# EAGLE design CrackberryPi (EAGLE 6.5.0)
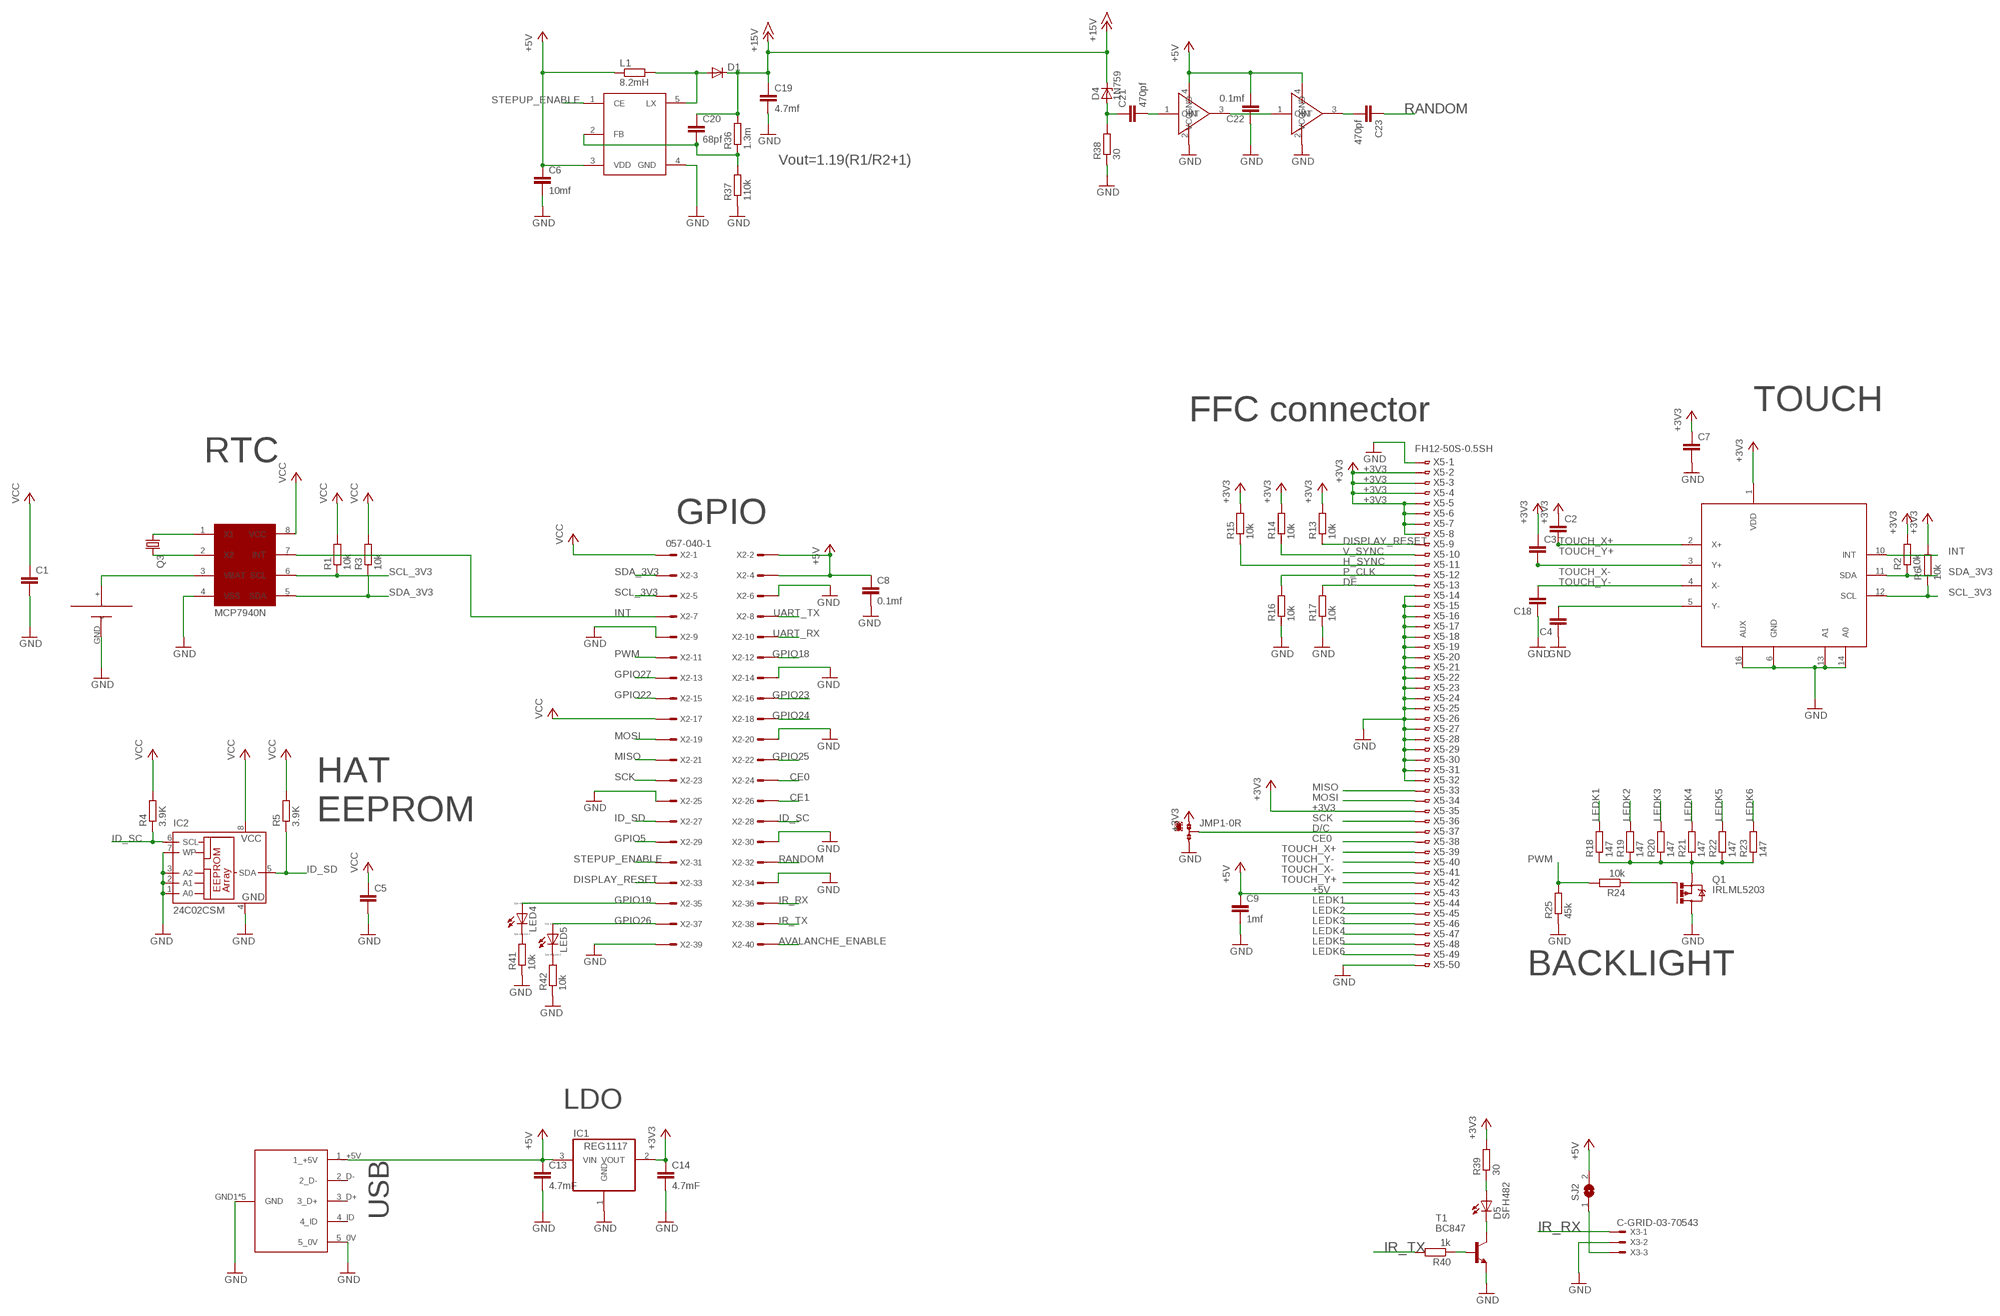
[diagram p0: schematic, sheet 1]

## Parts
C1  C-EUC0603  [C0603]
C2  C-EUC0603  [C0603]
C3  C-EUC0603  [C0603]
C4  C-EUC0603  [C0603]
C5  C-EUC0603  [C0603]
C6  10mf  C-EUC0603  [C0603]
C7  C-EUC0603  [C0603]
C8  0.1mf  C-EUC0603  [C0603]
C9  1mf  C-EUC0603  [C0603]
C13  4.7mF  C-EUC0603  [C0603]
C14  4.7mF  C-EUC0603  [C0603]
C18  C-EUC0603  [C0603]
C19  4.7mf  C-EUC0603  [C0603]
C20  68pf  C-EUC0603  [C0603]
C21  470pf  C-EUC0603  [C0603]
C22  0.1mf  C-EUC0603  [C0603]
C23  470pf  C-EUC0603  [C0603]
D1  DIODE-SOD123  [SOD123]
D4  1N759  ZENER-DIODESOD80C  [SOD80C]
D5  SFH482  [SFH482]
IC1  REG1117  [SOT223]
IC2  24C02CSM  [SO-08M]
JMP1  0R-JUMPC  [C0R-JMP]
L1  8.2mH  R-EU_R1210  [R1210]
LED4  LED_ESML0603  [LED_SML0603]
LED5  LED_ESML0603  [LED_SML0603]
Q1  IRLML5203  [MICRO3]
Q3  CRYSTALMM20SS  [MM20SS]
R1  10k  R-EU_R0603  [R0603]
R2  10k  R-EU_R0603  [R0603]
R3  10k  R-EU_R0603  [R0603]
R4  3.9K  R-EU_R0603  [R0603]
R5  3.9K  R-EU_R0603  [R0603]
R6  10k  R-EU_R0603  [R0603]
R13  10k  R-EU_R0603  [R0603]
R14  10k  R-EU_R0603  [R0603]
R15  10k  R-EU_R0603  [R0603]
R16  10k  R-EU_R0603  [R0603]
R17  10k  R-EU_R0603  [R0603]
R18  147  R-EU_R0603  [R0603]
R19  147  R-EU_R0603  [R0603]
R20  147  R-EU_R0603  [R0603]
R21  147  R-EU_R0603  [R0603]
R22  147  R-EU_R0603  [R0603]
R23  147  R-EU_R0603  [R0603]
R24  10k  R-EU_R0603  [R0603]
R25  45k  R-EU_R0603  [R0603]
R36  1.3m  R-EU_R0603  [R0603]
R37  110k  R-EU_R0603  [R0603]
R38  30  R-EU_R0603  [R0603]
R39  30  R-EU_R0603  [R0603]
R40  1k  R-EU_R0603  [R0603]
R41  10k  R-EU_R0603  [R0603]
R42  10k  R-EU_R0603  [R0603]
SJ2  SJ  [SJ]
T1  BC847  [SOT23]
U$2  NCP1406  [SOT23-5L]
U$3  MAX2650  [SOT143-W]
U$4  CR1216  [CR1216]
U$5  MCP7940N  [SO08]
U$6  TSC2007  [TSSOP16]
U$9  MICRO_USB  [MICRO_USB]
U$10  MAX2650  [SOT143-W]
X2  057-040-1  [057-040-1]
X3  C-GRID-03-70543  [70543-03]
X5  FH12-50S-0.5SH  [FH12-50S-0.5SH]

## Nets
+3V3: C2.1 C3.1 C7.1 C14.1 IC1.2(VOUT) JMP1.1 R2.2 R6.2 R13.2 R14.2 R15.2 R39.2 U$6.1(VDD) X5.2 X5.3 X5.4 X5.5 X5.6 X5.7 X5.8 X5.35
+5V: C6.1 C8.1 C9.1 C13.1 C22.2 IC1.3(VIN) L1.1 SJ2.2 U$2.3(VDD) U$3.4(VCC) U$9.1_+5V U$10.4(VCC) X2.2 X2.4 X5.43
+15V: C19.1 C20.1 D1.C D4.C R36.2
AVALANCHE_ENABLE: X2.40
BASE: R40.1 T1.1(B)
CE0: X2.24 X5.38
CE1: X2.26
COLLECTOR: D5.K(C) T1.3(C)
D/C: JMP1.2 X5.37
DE: R17.2 X5.13
DISPLAY_RESET: R13.1 X2.33 X5.9
EMITTER: T1.2(E) ; supply symbol labelled GND
FB: C20.2 R36.1 R37.2 U$2.2(FB)
GND: C1.2 C4.1 C5.2 C6.2 C7.2 C8.2 C9.2 C13.2 C14.2 C18.1 C19.2 C22.1 IC1.1(GND) IC2.1(A0) IC2.2(A1) IC2.3(A2) IC2.4(GND) IC2.7(WP) JMP1.3 Q1.3(D) R16.1 R17.1 R25.1 R37.1 R38.1 R41.1 R42.1 U$2.4(GND) U$3.2(GND) U$4.GND(-) U$5.4(VSS) U$6.6(GND) U$6.13(A1) U$6.14(A0) U$6.16(AUX) U$9.5_0V U$9.GND1(GND) U$9.GND2(GND) U$9.GND5(GND) U$9.P$1(GND) U$9.P$7(GND) U$10.2(GND) X2.6 X2.9 X2.14 X2.20 X2.25 X2.30 X2.34 X2.39 X3.2 X5.1 X5.14 X5.15 X5.16 X5.17 X5.18 X5.19 X5.20 X5.21 X5.22 X5.23 X5.24 X5.25 X5.26 X5.27 X5.28 X5.29 X5.30 X5.31 X5.32 X5.50
GPIO5: X2.29
GPIO18: X2.12
GPIO19: LED4.A X2.35
GPIO22: X2.15
GPIO23: X2.16
GPIO24: X2.18
GPIO25: X2.22
GPIO26: LED5.A X2.37
GPIO27: X2.13
H_SYNC: R15.1 X5.11
ID_SC: IC2.6(SCL) R4.1 X2.28
ID_SD: IC2.5(SDA) R5.1 X2.27
IN_1: C21.2 U$3.1(IN)
INT: U$5.7(INT) U$6.10(INT) X2.7
IR_RX: X2.36 X3.1
IR_TX: R40.2 X2.38
LEDK1: R18.2 X5.44
LEDK2: R19.2 X5.45
LEDK3: R20.2 X5.46
LEDK4: R21.2 X5.47
LEDK5: R22.2 X5.48
LEDK6: R23.2 X5.49
LX: D1.A L1.2 U$2.5(LX)
MISO: X2.21 X5.33
MOSI: X2.19 X5.34
N$4: SJ2.1 X3.3
N$12: Q1.2(S) R18.1 R19.1 R20.1 R21.1 R22.1 R23.1
N$16: C21.1 D4.A R38.2
N$20: Q1.1(G) R24.1
N$30: D5.A R39.1
N$35: LED4.C R41.2
N$36: LED5.C R42.2
OUT1_IN2: U$3.3(OUT) U$10.1(IN)
OUT2: C23.2 U$10.3(OUT)
P_CLK: R16.2 X5.12
PWM: R24.2 R25.2 X2.11
RANDOM: C23.1 X2.32
SCK: X2.23 X5.36
SCL_3V3: R1.1 R6.1 U$5.6(SCL) U$6.12(SCL) X2.5
SDA_3V3: R2.1 R3.1 U$5.5(SDA) U$6.11(SDA) X2.3
STEPUP_ENABLE: U$2.1(CE) X2.31
TOUCH_X+: C2.2 U$6.2(X+) X5.39
TOUCH_X-: C18.2 U$6.4(X-) X5.41
TOUCH_Y+: C3.2 U$6.3(Y+) X5.42
TOUCH_Y-: C4.2 U$6.5(Y-) X5.40
UART_RX: X2.10
UART_TX: X2.8
V_SYNC: R14.1 X5.10
VBAT+: U$4.+ U$5.3(VBAT)
VCC: C1.1 C5.1 IC2.8(VCC) R1.2 R3.2 R4.2 R5.2 U$5.8(VCC) X2.1 X2.17
X1_RTC: Q3.1 U$5.1(X1)
X2_RTC: Q3.4 U$5.2(X2)
Unconnected: U$9.2_D- U$9.3_D+ U$9.4_ID

## Notes on the sheet
- Vout=1.19(R1/R2+1)
- FFC connector | TOUCH
- RTC
- GPIO
- MCP7940N
- HAT
  EEPROM
- BACKLIGHT
- LDO
- USB

## Library data of the parts
C1-C9 C13 C14 C18-C23 = rcl:C-EU: CAPACITOR, European symbol
D1 = diode:DIODE-: DIODE
D4 = diode:ZENER-DIODE: Z-Diode
D5 = led:SFH482: IR LED infrared emitting diode, Infineon
IC1 = burr-brown:REG1117: 800mA and 1A Low Dropout (LDO) Positive Regulator 1.8V, 2.5V, 2.85V, 3.3V, 5V, and Adj; MPN: REG1117; OC_FARNELL: 1097566; OC_NEWARK: 14P6981
IC2 = microchip:24C*: Serial EEPROM 1 K/2 K/4 K; MF: MICROCHIP; MPN: 24C02C-I/SN; OC_FARNELL: 1084339; OC_NEWARK: 96K4063
JMP1 = jump-0r-smd:0R-JUMP: SMD 0R 0805 Jumper
L1 R1-R6 R13-R25 R36-R42 = rcl:R-EU_: RESISTOR, European symbol
LED4 LED5 = eagle-ltspice:LED_E: LED Source: http://www.osram.convergy.de Source: www.luxeon.com Source: www.kingbright.com; SPICEMODEL: NONE; SPICEPREFIX: D; SPICETYPE: diode
Q1 = transistor-power:IRLML5203: HEXFET P-Channel Power MOSFET
Q3 = crystal:CRYSTAL: CRYSTAL; OC_FARNELL: unknown; OC_NEWARK: unknown
SJ2 = jumper:SJ: SMD solder JUMPER
T1 = transistor:BC847: NPN TRANSISTOR
U$2 = ncp1406:NCP1406
U$3 U$10 = max2650:MAX2650
U$4 = cr1216:CR1216
U$5 = MCP7940N:MCP7940N
U$6 = tsc2046:TSC2007
U$9 = MICRO_USB:MICRO_USB
X2 = con-panduit:057-040-: CONNECTOR 40-pin series 057 contact pc board low profile headers; OC_FARNELL: unknown; OC_NEWARK: unknown
X3 = con-molex:C-GRID-03: CONNECTOR wire to board 2.54 mm (0.100") pitch header; OC_FARNELL: unknown; OC_NEWARK: unknown
X5 = FCI_62684:FH12-50S-0.5S: 0.5mm Pitch Connectors For FPC/FFC Source: Data sheet <http://www.hirose.co.jp/cataloge_hp/e58605370.pdf>; MPN: FH12-50S-0.5SH(55); OC_FARNELL: 1324557; OC_NEWARK: 34M6181

## Board
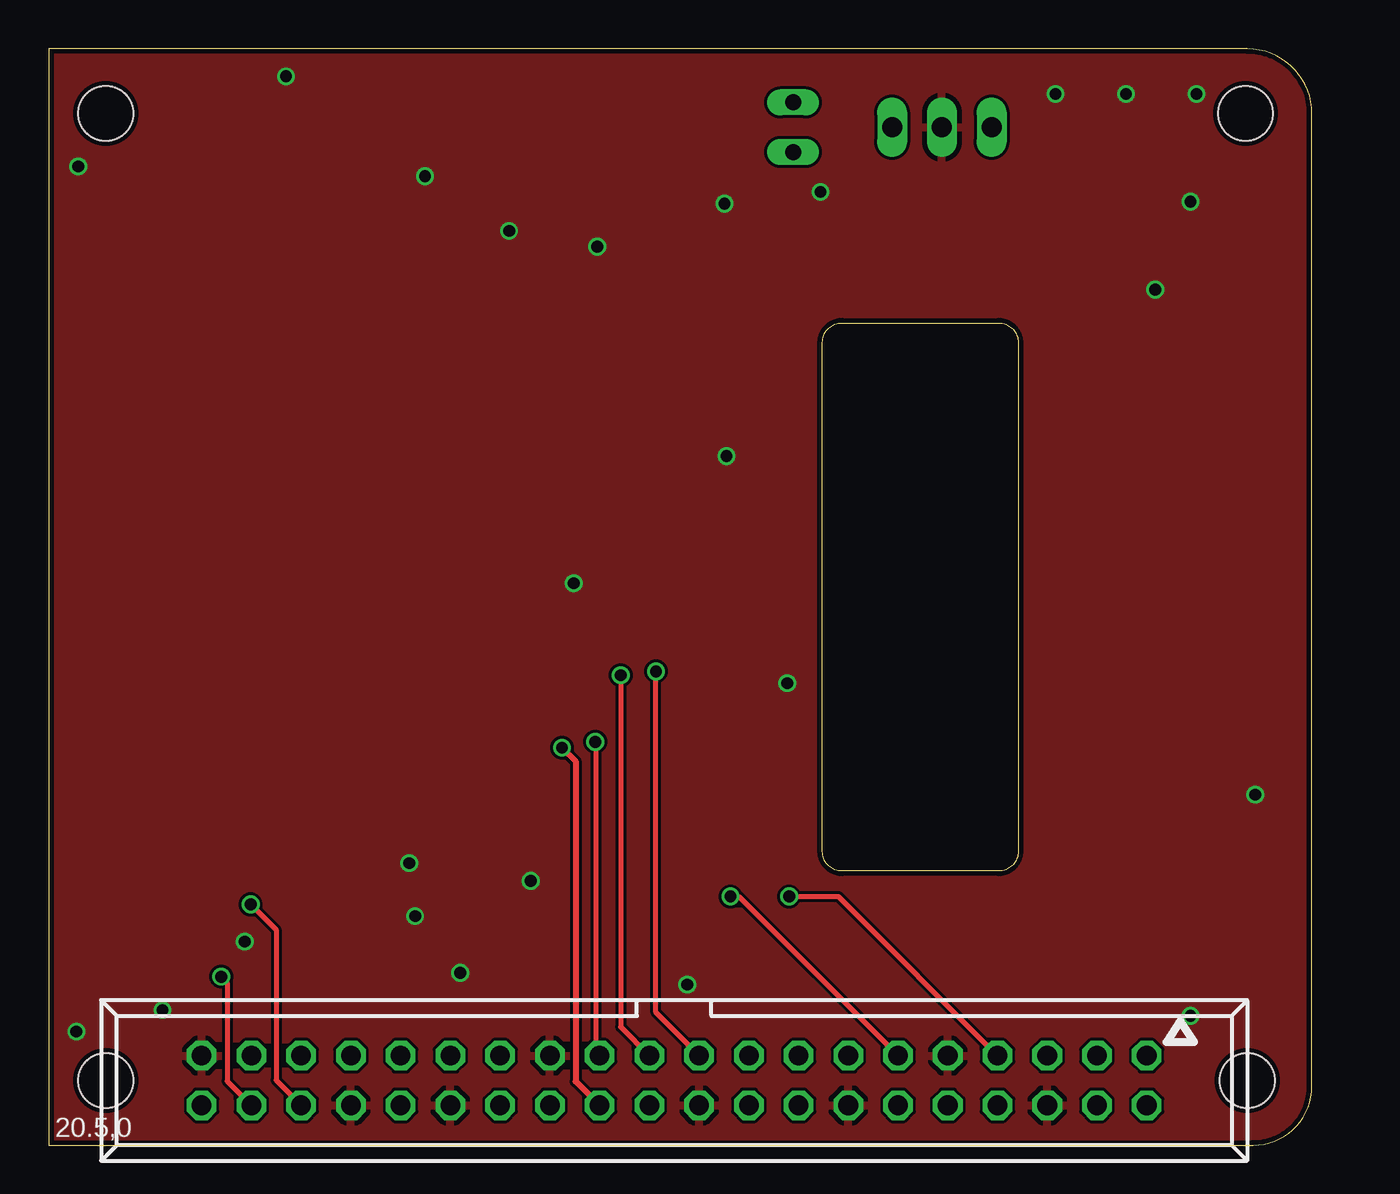
[diagram p1: board, top side]
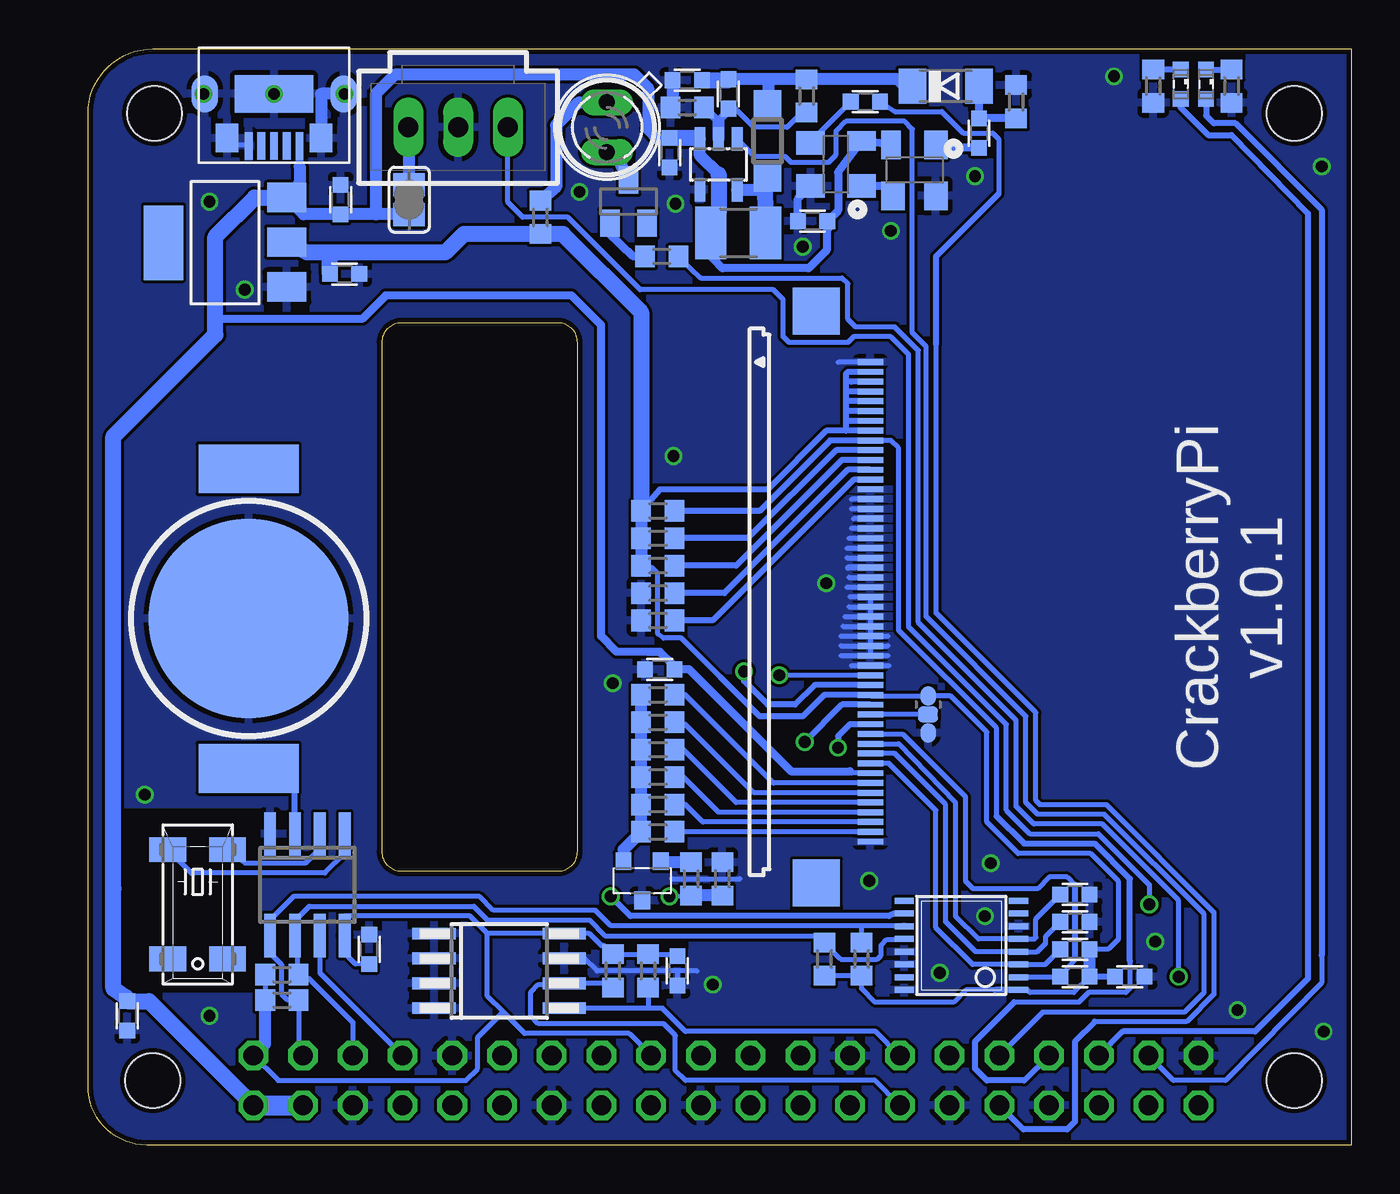
[diagram p2: board, bottom side, seen from below]

Size 64.5 x 56 mm. Coordinates in mm from the lower left corner, seen from the top.
Outline: 0,0 61.5,0 arc90 64.5,3 64.5,52.7 arc90 61.2,56 0,56 0,0
Outline: 39.5,15 39.5,41 arc-90 40.5,42 48.5,42 arc-90 49.5,41 49.5,15 arc-90 48.5,14 40.5,14 arc-90 39.5,15
Copper layers (1*16): Top 0.035mm / dielectric 1.5mm / Bottom 0.035mm
Design rules "SeeedStudio_2layer_DRU_no_angle_20140221": minimum track width 6mil, minimum drill 12mil, track to track 6mil, track to pad 6mil, pad to pad 6mil, via to via 6mil, smd to smd 0mil, copper to edge 10mil, drill to drill 10mil, minimum pad ring 10mil, minimum via ring 6mil, stop-mask expansion 2mil, vias tented up to drill 100mil, thermal gap 10mil
Holes 2.8 mm at 61.2,3.3 61.1,52.7 2.9,52.7 2.9,3.3
bRestrict: area 55.7,7.8 to 62.8,17.2

### Footprints (pad centres in the part's own frame; a part is rotated, then mirrored left to right if it is on the bottom)
C0603 = smd 0.8 x 0.8: 1 -0.75,0; 2 0.75,0
SOD123 = smd 1.4 x 1.4: A 1.9,0; C -1.9,0
SOD80C = smd 1.4 x 1.8: A 1.7,0; C -1.7,0
SFH482 = drill 0.813 long: A -1.27,0; K 1.27,0
SOT223 = smd 1.499 x 2.007: 1 -2.261,-3.15; 2 0.025,-3.15; 3 2.311,-3.15 | smd 3.81 x 2.007: 4 0,3.15
SO-08M = smd 0.6 x 2.2: 1 -1.905,-3.33; 2 -0.635,-3.33; 3 0.635,-3.33; 4 1.905,-3.33; 5 1.905,3.33; 6 0.635,3.33; 7 -0.635,3.33; 8 -1.905,3.33
C0R-JMP = smd 0.8 x 1: 1 0,0.938; 3 0,-0.938 | smd 1 x 0.8: 2 0,0
R1210 = smd 1.6 x 2.7: 1 -1.4,0; 2 1.4,0
LED_SML0603 = smd 0.8 x 0.8: A 0.75,0; C -0.75,0
MICRO3 = smd 0.8 x 0.9: 1 -0.95,-1; 2 0.95,-1; 3 0,1
MM20SS = smd 1.27 x 1.88: 1 -2.794,-1.524; 2 2.794,-1.524; 3 2.794,1.524; 4 -2.794,1.524
R0603 = smd 1 x 1.1: 1 -0.85,0; 2 0.85,0
SJ = smd 1.168 x 1.6: 1 -0.762,0; 2 0.762,0
SOT23 = smd 1 x 1.4: 1 -0.95,-1.1; 2 0.95,-1.1; 3 0,1.1
SOT23-5L = smd 0.55 x 1.2: 1 -0.95,-1.3; 2 0,-1.3; 3 0.95,-1.3; 4 0.95,1.3; 5 -0.95,1.3
SOT143-W = smd 1.2 x 1.45: 1 -1.1,-1.3; 2 -1.1,1.3; 3 1.1,1.3 | smd 1 x 1.45: 4 1.2,-1.3
CR1216 = smd 2.5 x 5.1: + -7.65,0; P$2 7.65,0 | smd 10.2 x 10.2: GND 0,0
SO08 = smd 0.6 x 2.2: 1 -1.905,-2.6; 2 -0.635,-2.6; 3 0.635,-2.6; 4 1.905,-2.6; 5 1.905,2.6; 6 0.635,2.6; 7 -0.635,2.6; 8 -1.905,2.6
TSSOP16 = smd 0.305 x 0.991: 1 -2.275,-2.918; 2 -1.625,-2.918; 3 -0.975,-2.918; 4 -0.325,-2.918; 5 0.325,-2.918; 6 0.975,-2.918; 7 1.625,-2.918; 8 2.275,-2.918; 9 2.275,2.918; 10 1.625,2.918; 11 0.975,2.918; 12 0.325,2.918; 13 -0.325,2.918; 14 -0.975,2.918; 15 -1.625,2.918; 16 -2.275,2.918
MICRO_USB = smd 0.4 x 1.4: 1_+5V -1.3,2.65; 2_D- -0.65,2.65; 3_D+ 0,2.65; 4_ID 0.65,2.65; 5_0V 1.3,2.65 | smd 4 x 1.9: GND1 0,0 | smd 1.35 x 1.9: GND2 -3.55,0; GND5 3.55,0 | smd 1.15 x 1.45: P$1 -2.4,2.25; P$7 2.4,2.25
057-040-1 = drill 1 octagon: 1 -24.13,-1.27; 2 -24.13,1.27; 3 -21.59,-1.27; 4 -21.59,1.27; 5 -19.05,-1.27; 6 -19.05,1.27; 7 -16.51,-1.27; 8 -16.51,1.27; 9 -13.97,-1.27; 10 -13.97,1.27; 11 -11.43,-1.27; 12 -11.43,1.27; 13 -8.89,-1.27; 14 -8.89,1.27; 15 -6.35,-1.27; 16 -6.35,1.27; 17 -3.81,-1.27; 18 -3.81,1.27; 19 -1.27,-1.27; 20 -1.27,1.27; 21 1.27,-1.27; 22 1.27,1.27; 23 3.81,-1.27; 24 3.81,1.27; 25 6.35,-1.27; 26 6.35,1.27; 27 8.89,-1.27; 28 8.89,1.27; 29 11.43,-1.27; 30 11.43,1.27; 31 13.97,-1.27; 32 13.97,1.27; 33 16.51,-1.27; 34 16.51,1.27; 35 19.05,-1.27; 36 19.05,1.27; 37 21.59,-1.27; 38 21.59,1.27; 39 24.13,-1.27; 40 24.13,1.27
70543-03 = drill 1.016 long: 1 -2.54,0; 2 0,0; 3 2.54,0
FH12-50S-0.5SH = smd 1.3 x 0.3: 1 3.95,27.8; 2 3.95,27.3; 3 3.95,26.8; 4 3.95,26.3; 5 3.95,25.8; 6 3.95,25.3; 7 3.95,24.8; 8 3.95,24.3; 9 3.95,23.8; 10 3.95,23.3; 11 3.95,22.8; 12 3.95,22.3; 13 3.95,21.8; 14 3.95,21.3; 15 3.95,20.8; 16 3.95,20.3; 17 3.95,19.8; 18 3.95,19.3; 19 3.95,18.8; 20 3.95,18.3; 21 3.95,17.8; 22 3.95,17.3; 23 3.95,16.8; 24 3.95,16.3; 25 3.95,15.8; 26 3.95,15.3; 27 3.95,14.8; 28 3.95,14.3; 29 3.95,13.8; 30 3.95,13.3; 31 3.95,12.8; 32 3.95,12.3; 33 3.95,11.8; 34 3.95,11.3; 35 3.95,10.8; 36 3.95,10.3; 37 3.95,9.8; 38 3.95,9.3; 39 3.95,8.8; 40 3.95,8.3; 41 3.95,7.8; 42 3.95,7.3; 43 3.95,6.8; 44 3.95,6.3; 45 3.95,5.8; 46 3.95,5.3; 47 3.95,4.8; 48 3.95,4.3; 49 3.95,3.8; 50 3.95,3.3 | smd 2.4 x 2.4: P$1 1.2,1.2; P$2 1.2,30.4

### Placement (x,y rotation side)
C1  50.14,10 90 bottom
C2  14.1,8.6 180 bottom
C3  14.1,10 180 bottom
C4  14.1,12.8 180 bottom
C5  34.4,8.9 270 bottom
C6  34.8,50.7 270 bottom
C7  11.3,8.6 0 bottom
C8  62.5,6.6 270 bottom
C9  35.3,24.3 180 bottom
C13  51.6,48.3 90 bottom
C14  51.4,44.5 0 bottom
C18  14.1,11.4 180 bottom
C19  33.9,54.4 180 bottom
C20  31.8,53.7 270 bottom
C21  19,51.7 270 bottom
C22  27.5,47.2 0 bottom
C23  24.8,53.3 180 bottom
D1  29.8,51.3 270 bottom
D4  20.7,54.1 0 bottom
D5  38,52 270 bottom
IC1  57.5,46.1 90 bottom
IC2  43.5,8.9 270 bottom
JMP1  21.6,22 0 bottom
L1  31.3,46.6 0 bottom
LED4  8.7,54.2 270 bottom
LED5  7.4,54.2 270 bottom
Q1  36.2,13.5 180 bottom
Q3  58.9,12.3 270 bottom
R1  54.6,8.7 180 bottom
R2  25,9.5 270 bottom
R3  54.6,7.4 180 bottom
R4  37.7,8.9 90 bottom
R5  35.9,8.9 90 bottom
R6  26.9,9.5 270 bottom
R13  35.4,32.4 180 bottom
R14  35.4,31 180 bottom
R15  35.4,29.6 180 bottom
R16  35.4,28.2 0 bottom
R17  35.4,26.8 0 bottom
R18  35.4,23 0 bottom
R19  35.4,21.6 0 bottom
R20  35.4,20.2 0 bottom
R21  35.4,18.8 0 bottom
R22  35.4,17.4 0 bottom
R23  35.4,16 0 bottom
R24  33.7,13.6 270 bottom
R25  32.1,13.6 270 bottom
R36  27.8,53.6 90 bottom
R37  33.9,53 0 bottom
R38  17.1,53.3 270 bottom
R39  41.4,47.4 270 bottom
R40  35.2,45.4 0 bottom
R41  10.1,54.1 90 bottom
R42  6.1,54.1 90 bottom
SJ2  48.1,48.3 270 bottom
T1  36.9,48.2 0 bottom
U$2  32.3,50.1 180 bottom
U$3  22.3,49.8 180 bottom
U$4  56.3,26.9 90 bottom
U$5  53.3,13.3 180 bottom
U$6  19.9,10.2 90 bottom
U$9  55,53.7 180 bottom
U$10  26.3,50.1 90 bottom
X2  31.93,3.3 180 top
X3  45.6,52 180 bottom
X5  28.5,12.2 0 bottom

### Tracks (layer width: path | path; a pad name or v marks a point on that pad's centre or on a via)
+3V3
  Bottom 0.254: C2.1 14.15,7.8 16.4,7.8 16.52,7.92 U$6.1 | R6.2 R2.2 25,8 24.3,7.3 20.3,7.3 19.68,7.92 18.18,7.92 | R15.2 36.15,29.5 35.7,29.5 35.4,29.2 35.4,26.1 35.1,25.9 34.2,25.9 32.2,23.9 | C3.1 12.4,10 11.9,10.5 11.9,13.5 13.3,14.9 17,14.9 18.6,16.5 18.6,21.1 20.44,22.94 JMP1.1 24.49,22.94 X5.35
  Bottom 0.305: X5.5 25.8,38 | 25.8,38 25.8,37.5 | 25.8,37.5 25.8,37 | R13.2 36.2,32.45 35.3,33.5 29.8,33.5 26.8,36.5 X5.8 25.8,36.5 25.8,37 | X5.7 25.8,37 | X5.6 25.8,37.5 | X5.4 25.7,38.5 25.8,38.4 | 25.8,38.4 25.8,38 | 25.5,39 X5.3 25.8,39 | X5.2 25.7,39.5 25.8,39.4 25.8,39 | 25.8,39 25.8,38.4 | U$6.1 18.18,7.92 | X5.35 26.9,23 28,21.9 30.2,21.9 32.2,23.9 | C7.1 C2.1
  Bottom 0.61: R13.2 R14.2 R15.2 | C2.1 C3.1
  Bottom 0.813: R39.2 45.31,46.55 46.26,45.6 51.9,45.6 | 41.4,46.5 R39.2 | 51.9,45.6 53.33,45.6 IC1.2 | C14.1 52.15,45.35 51.9,45.6 | R13.2 36.25,42.55 40.25,46.55 R39.2
+5V
  Bottom 0.254: X5.43 25.5,19 25.6,19.1 | 33.8,24.3 34.6,24.2
  Bottom 0.305: U$2.3 33.5,51.45
  Bottom 0.406: U$3.4 U$10.4 26.2,49.7 26.2,47.75 C22.2 | 26.55,47.4 C22.2 | C22.2 26.65,46.85 | 53.7,50 U$9.1_+5V | C9.1 33.8,24.3 28.6,19.1 25.6,19.1 | 32.6,46.7 32.6,45.3 32.1,44.8 27.7,44.8 26.75,45.75 C22.2 | 34.6,24.2 34.6,24.5 35.3,25.2 37.5,25.2 38.3,26 38.3,41.9 39.8,43.4 49.3,43.4 50.5,42.2 58,42.2 | 63.1,13.3 63.2,13.1
  Bottom 0.61: C6.1 34.75,51.4 35.4,51.4 35.9,51.9 35.9,54 36.6,54.7 48.8,54.7 49.8,53.7 49.8,47.55 | 32.3,49.6 33.25,50.55 U$2.3 | 49.8,47.55 C13.1 53.49,47.55 IC1.3 53.7,49.16 53.7,50 | SJ2.2 49.8,47.55
  Bottom 0.813: 33.5,51.45 C6.1 | 32.3,49.6 32.3,47.6 32.6,46.7 32.8,46.8 L1.1 | X2.2 61.38,7.35 C8.1 62.55,7.55 63.2,8 63.2,13.1 63.2,36.2 58,41.4 58,42.2 58,46.4 55.99,48.41 IC1.3
  Bottom 1.016: X2.2 X2.4
+15V
  Bottom 0.406: D4.C 22.9,54.2
  Bottom 0.61: 22.9,54.2 23.15,54.45 R36.2 29.6,54.45 | 29.6,54.45 C20.1 | D1.C 29.7,54.35 29.6,54.45
  Bottom 0.813: C19.1 31.85,54.4 C20.1
BASE
  Bottom 0.406: R40.1 36.65,45.4 37.9,46.6 37.95,47.05 T1.1
CE0  (via drill 0.6)
  Top 0.305: X2.24 26.9,3.25 26.9,19.6 v26.2,20.3
  Bottom 0.305: X5.38 25.6,21.5 26.2,20.9 v26.2,20.3
COLLECTOR
  Bottom 0.61: D5.K 37.7,50.93 T1.3
D/C
  Bottom 0.254: JMP1.2 X5.37
DE
  Bottom 0.305: X5.13 25.4,34 32.6,26.8 R17.2
DISPLAY_RESET
  Bottom 0.254: 11.3,9.4 11.3,8 11.5,7.8 13.4,7.8 13.9,7.3 17.2,7.3 | 18.1,16.8 18.1,21.3 23.1,26.3 23.1,35.6 23.5,36 X5.9
  Bottom 0.305: X5.9 26.6,36 30.2,32.4 R13.1 | X2.33 16.69,3.3 18.6,3.3 19.2,3.9 19.2,5.3 17.2,7.3 | 18.1,16.8 16.7,15.4 13.1,15.4 11.3,13.6 11.3,9.4
FB
  Bottom 0.254: R36.1 28.05,52.75 28.8,52 30.5,52 31.45,52.95 C20.2
  Bottom 0.406: R37.2 32.3,52.3 31.85,52.8 C20.2
  Bottom 0.61: U$2.2 32.3,52.3
GND  (via drill 0.6)
  Bottom 0.254: X5.26 X5.25 25.6,28 | X5.26 X5.31 | U$9.P$7 57.05,51.1 56.3,51.1 | 25.65,31 X5.19 | 25.5,24.5 23.6,24.5 | 24.7,33 25.5,33 | 24.7,32.5 25.5,32.5 | X5.17 25.4,32 | 24.7,31.5 25.5,31.5 | 25.75,30.5 24.65,30.5 | 25.75,30 24.65,30 | 25.65,29 X5.23 | 25.75,28.5 24.65,28.5 | 25.65,27.5 X5.26 | 25.95,26.5 24.85,26.5 | 26.05,25.5 23.65,25.5 | 26.05,26 23.65,26 | 26.05,25 23.65,25 | X5.1 26.2,40 | 33.4,8.9 34.4,8.9 | 34.4,8.9 38.5,8.9 39.1,9.5 40.3,9.5 | 34.4,8.9 34.4,8.1 | 25.85,27 24.75,27 | 34.7,13.6 31.2,13.6
  Bottom 0.305: 24.6,29.5 25.7,29.5
  Bottom 0.406: C22.1 28.25,48.35 U$10.2
  Bottom 0.61: C19.2 34.65,53.1 R37.1 | U$9.GND2 52.6,53.7 U$9.P$1
  other vias: 1.4,5.8 1.5,50 34.5,48.1 39.4,48.7 34.6,35.2 18.7,11.7 37.7,23.6 12.1,54.6 19.2,49.5 51.4,53.7 58.6,53.7 55,53.7 18.4,14.4 26.8,28.7 56.5,43.7 21,8.8 28,45.9 23.5,46.7 10,10.4 5.8,6.9 32.6,8.2 24.6,13.5 61.6,17.9 58.3,6.6 58.3,48.2
  pour Bottom: 0,0 61.49,0 arc90 64.5,3.01 64.5,52.6 arc90 61.1,56 0,56
  pour Top: 4.4,0 61.5,0 arc90 64.5,3 64.5,52.6 arc90 61.1,56 0,56 0,0.1
GPIO19
  Bottom 0.305: LED4.A 8.7,53 7.3,51.6 6.1,51.6 2.2,47.6 2.2,8.5 4.9,5.8 11.65,5.8 X2.35
GPIO26
  Bottom 0.254: 1.5,9.7 1.5,8.3 6.4,3.3 9.07,3.3 X2.37
  Bottom 0.305: LED5.A 7.4,52.6 7,52.2 5.9,52.2 1.5,47.8 1.5,9.7
H_SYNC
  Bottom 0.305: X5.11 26,35 31.4,29.6 R15.1
ID_SC
  Bottom 0.254: R4.1 38.02,8.27 IC2.6 40.23,8.2 41.5,8.2 41.9,7.8 41.9,6.6 41.5,6.2 35.1,6.2 34.5,5.6 34.5,3.8 34,3.3 24.31,3.3 X2.28
ID_SD
  Bottom 0.254: X2.27 24.27,5.8 34,5.8 35.2,7 35.9,7 | IC2.5 35.9,7 | R5.1 35.9,7
IN_1
  Bottom 0.406: C21.2 20.85,50.95 U$3.1
INT  (via drill 0.6)
  Top 0.254: v37.8,12.7 40.31,12.7 X2.7
  Bottom 0.254: 48.44,5.04 X2.7 52.66,8.79 U$5.7
  Bottom 0.305: U$6.10 23.27,11.82 23.6,11.7 36.8,11.7 v37.8,12.7
IR_RX  (via drill 0.6)
  Top 0.254: v10.3,12.3 11.6,11 11.6,3.31 X2.36
  Bottom 0.254: v10.3,12.3 10.3,13.3 12.9,15.9 16.4,15.9 17.6,17.1 17.6,21.5 22.6,26.5 22.6,40.4 23.5,41.3 25.4,41.3 25.7,41 28.7,41 29,41.3 29,43.2 29.5,43.7 36.3,43.7 40,47.4 42.3,47.4 43.06,48.16 X3.1
IR_TX  (via drill 0.6)
  Top 0.254: v8.8,8.6 9.1,8.3 9.1,3.27 X2.38
  Bottom 0.254: R40.2 33.2,44.3 26,44.3 25.7,44 25.7,42.2 25.3,41.8 23.3,41.8 22.1,40.6 22.1,26.7 17.1,21.7 17.1,17.3 16.2,16.4 12.7,16.4 8.8,12.5 v8.8,8.6
LEDK1
  Bottom 0.254: X5.44 29.5,18.5 34,23 R18.2
LEDK2
  Bottom 0.254: X5.45 30.5,18 34,21.5 34.58,21.5 R19.2
LEDK3
  Bottom 0.254: X5.46 31.4,17.5 34.1,20.2 R20.2
LEDK4
  Bottom 0.254: X5.47 32.3,17 34.1,18.8 R21.2
LEDK5
  Bottom 0.254: X5.48 33.1,16.5 34,17.4 R22.2
LEDK6
  Bottom 0.254: X5.49 R23.2
LX
  Bottom 0.61: U$2.5 29.95,48.8
  Bottom 0.813: D1.A 29.95,48.8 L1.2
MISO  (via drill 0.6)
  Top 0.254: v29.2,24 29.2,6.03 X2.21
  Bottom 0.254: X5.33 v29.2,24
MOSI  (via drill 0.6)
  Top 0.254: X2.19 31,6.77 v31,24.2
  Bottom 0.305: X5.34 27.4,23.5 28.4,22.5 29.8,22.5 31,23.7 v31,24.2
N$4
  Bottom 0.61: SJ2.1 48.1,52.4 X3.3
N$12
  Bottom 0.61: R18.1 R19.1 R20.1 R21.1 R22.1 R23.1 37.15,15.1 Q1.2
N$16
  Bottom 0.406: D4.A C21.1 R38.2
N$20
  Bottom 0.61: R24.1 35.1,14.45 Q1.1
N$30
  Bottom 0.61: D5.A 39.43,53.27 40.6,52.1 40.6,48.95 R39.1
N$35
  Bottom 0.305: LED4.C R41.2
N$36
  Bottom 0.305: LED5.C R42.2
OUT1_IN2
  Bottom 0.406: U$3.3 23.7,49 U$10.1
OUT2
  Bottom 0.254: C23.2 27.6,51.25 U$10.3
P_CLK
  Bottom 0.305: X5.12 25.7,34.5 32,28.2 R16.2
PWM  (via drill 0.6)
  Top 0.254: v34.8,12.7 35.23,12.7 X2.11
  Bottom 0.254: v34.8,12.7 33.45,12.75 R24.2
  Bottom 0.61: R25.2 R24.2
RANDOM
  Bottom 0.254: 23.9,53.2 23.3,52.8 20.9,52.8 19.8,51.7 18.3,51.7 18,51.4 18,48.6 | 21.2,40.9 21.2,27.2 16.1,22.1 16.1,17.6 15.9,17.4 12.5,17.4 7,11.9 7,7.7 8.4,6.3 13.1,6.3
  Bottom 0.305: 23.9,53.2 C23.1 | 13.1,6.3 14.1,5.3 14.1,1.2 14.5,0.8 16.73,0.8 X2.32 | 18,48.6 21.2,45.4 21.2,40.9
SCK  (via drill 0.6)
  Top 0.254: X2.23 27.92,4.77 27.92,20.48 v27.9,20.6
  Bottom 0.305: X5.36 26,22.5 v27.9,20.6
SCL_3V3
  Bottom 0.254: U$6.12 22.84,10.5 23.7,10.5 24,10.2 24,9.7 24.2,9.5 26.05,9.5 R6.1 27.15,10.7 38.1,10.7 38.9,11.5 44.1,11.5 44.8,12.2 53.2,12.2 53.9,11.5 53.9,10.73 U$5.6 53.8,10.56 53.8,8.55 R1.1 53.55,8.5 53.2,8.5 50.98,6.28 X2.5
SDA_3V3
  Bottom 0.254: X2.3 53.75,4.94 R3.1 54.3,7.4 54.6,7.7 54.6,9.2 55.2,9.8 U$5.5 55.2,11.5 54,12.7 44.5,12.7 43.8,12 38.6,12 37.8,11.2 25,11.2 | 22.84,11.2 25,11.2 | R2.1 25,11.2
  Bottom 0.305: 22.84,11.2 U$6.11 22.79,11.2
STEPUP_ENABLE
  Bottom 0.254: X2.31 15.73,6.8 8.5,6.8 7.5,7.8 7.5,11.8 12.6,16.9 16,16.9 16.6,17.5 16.6,21.9 21.7,27 21.7,40.8 22.4,41.5 22.4,51.9 22.8,52.3 25.8,52.3 26.3,51.8 26.3,50.6 26.7,50.2 28.6,50.2 28.9,50.5 30.45,50.5 U$2.1
TOUCH_X+
  Bottom 0.254: 14.1,9.5 C2.2 15.32,8.57 U$6.2 | X5.39 22.9,21 19.7,17.8 19.7,13.5 19.3,13.1 16,13.1 15.4,13.7 14.5,13.7 14.1,13.3
  Bottom 0.305: 14.1,13.3 14.1,9.5
TOUCH_X-
  Bottom 0.254: C18.2 15.6,10.65 15.6,10.3 16.02,9.88 U$6.4 19.18,9.88 20.7,11.4 20.7,17.4 23.3,20 X5.41
TOUCH_Y+
  Bottom 0.254: X5.42 23.6,19.5 21.2,17.1 21.2,11.1 19.32,9.22 U$6.3 15.62,9.22 C3.2
TOUCH_Y-
  Bottom 0.254: 15.1,12.8 C4.2 16.1,11.55 16.1,10.6 16.18,10.53 U$6.5 19.02,10.53 20.2,11.7 20.2,17.5 23.1,20.5 X5.40
V_SYNC
  Bottom 0.305: X5.10 26.3,35.5 30.8,31 R14.1
VBAT+
  Bottom 0.305: U$5.3 53.94,18.04 55.5,19.6 56.55,19.5 U$4.+
VCC
  Bottom 0.254: R1.2 R3.2 | 44.1,10.8 IC2.8 38.91,10.8 38.3,10.2 38.15,10.2 R4.2 R5.2 34.3,9.75 C5.1 | 44.1,10.8 45,11.7 51.4,11.7 U$5.8 51.4,9.8 50.85,9.25 C1.1 | 43.3,6.8 42.2,5.7 36.87,5.7 X2.17 | 43.3,6.8 44.1,7.61 44.1,10.8 | 43.3,6.8 44.6,5.5 44.6,3.9 45.2,3.3 54.79,3.3 X2.1
  Bottom 0.61: X2.1 56,4.61 55.45,5.16 R3.2 | U$5.8
X1_RTC
  Bottom 0.254: U$5.1 51.4,14.9 52.4,13.9 59.23,13.9 Q3.1
X2_RTC
  Bottom 0.254: U$5.2 52.66,15.13 53.4,14.4 56.48,14.4 Q3.4

### Text on the board
bPlace: CrackberryPi / v1.0.1
tNames: 20.5,0